# Altium schematic sheet AUX_SteeringWheel_v5.SchDoc
size Letter
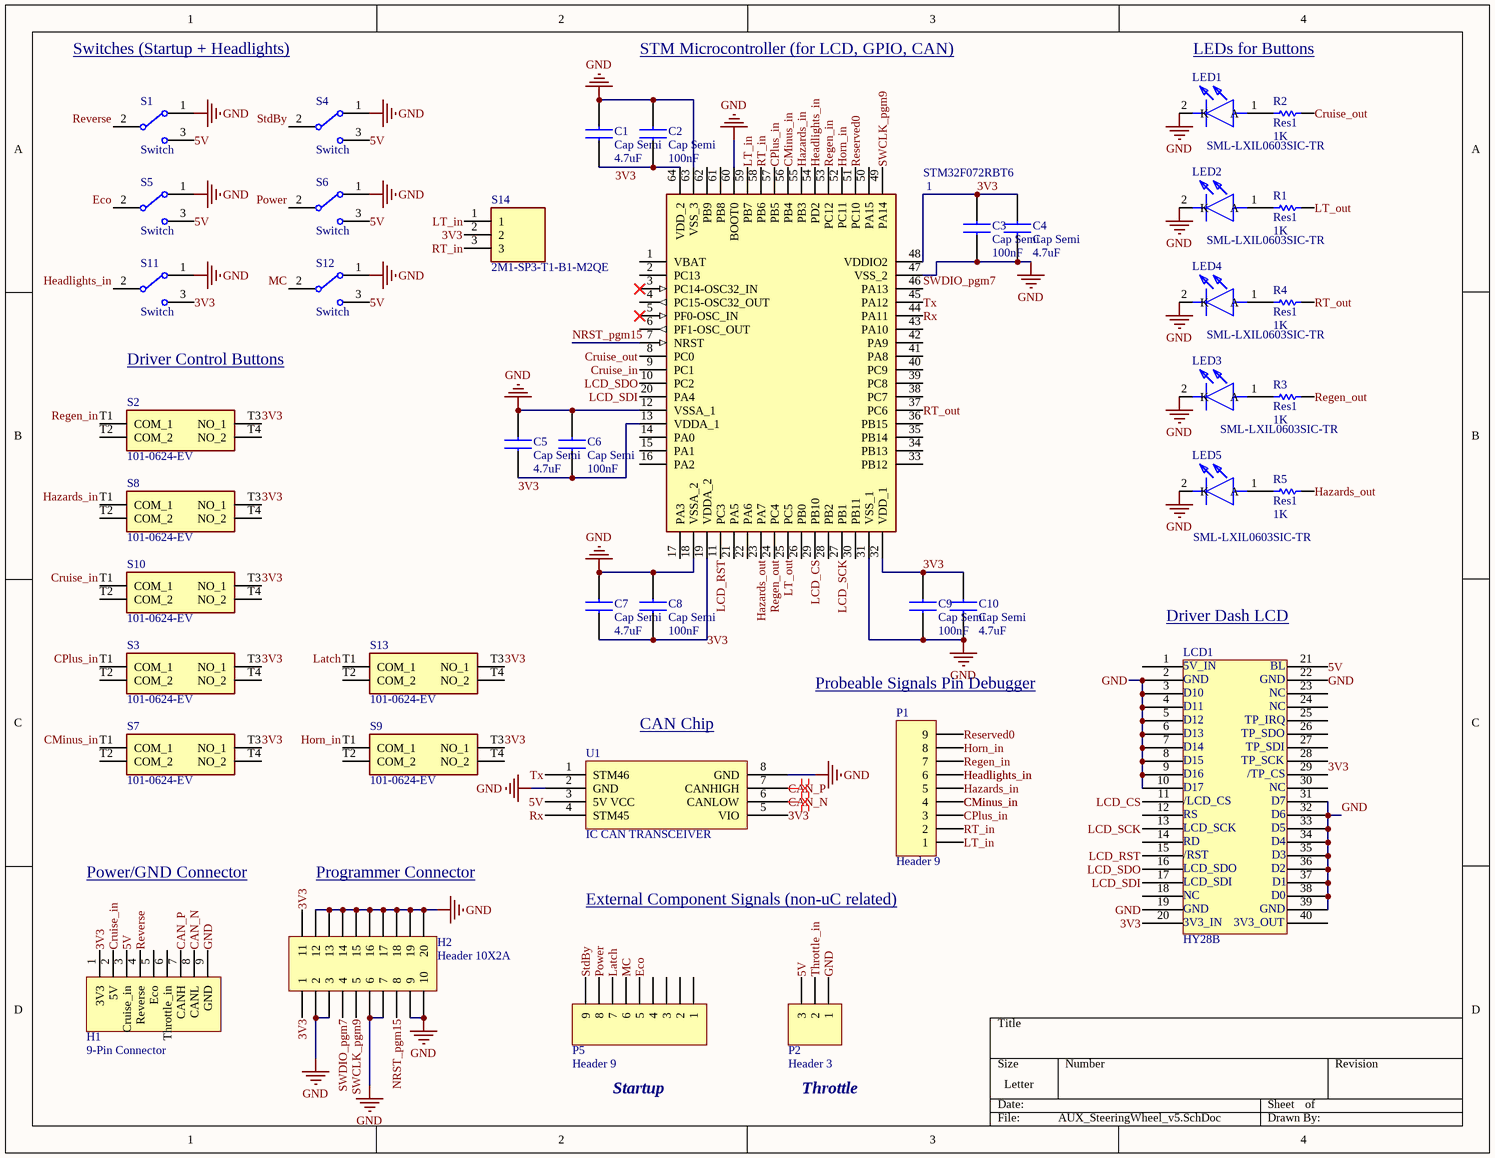
[diagram p0: AUX_SteeringWheel_v5.SchDoc]

## Parts
1  STM32F072RBT6  [QFP50P1200X1200X160-64N]
C1  Cap Semi  value 4.7uF  [CAPC3216X90N]
C2  Cap Semi  value 100nF  [CAPC3216X88N]
C3  Cap Semi  value 100nF  [CAPC3216X88N]
C4  Cap Semi  value 4.7uF  [CAPC3216X90N]
C5  Cap Semi  value 4.7uF  [CAPC3216X90N]
C6  Cap Semi  value 100nF  [CAPC3216X88N]
C7  Cap Semi  value 4.7uF  [CAPC3216X90N]
C8  Cap Semi  value 100nF  [CAPC3216X88N]
C9  Cap Semi  value 100nF  [CAPC3216X88N]
C10  Cap Semi  value 4.7uF  [CAPC3216X90N]
H1  9-Pin Connector  [Rt_Angle_9-Pin]
H2  Header 10X2A  [HDR2X10_CEN]
LCD1  HY28B
LED1  SML-LXIL0603SIC-TR  [LED thru hole]
LED2  SML-LXIL0603SIC-TR  [LED thru hole]
LED3  SML-LXIL0603SIC-TR  [LED thru hole]
LED4  SML-LXIL0603SIC-TR  [LED thru hole]
LED5  SML-LXIL0603SIC-TR  [LED thru hole]
P1  Header 9  [HDR1X9]
P2  Header 3  [HDR1X3]
P5  Header 9  [Rt_Angle_9-Pin]
R1  Res1  value 1K  [AXIAL-0.3]
R2  Res1  value 1K  [AXIAL-0.3]
R3  Res1  value 1K  [AXIAL-0.3]
R4  Res1  value 1K  [AXIAL-0.3]
R5  Res1  value 1K  [AXIAL-0.3]
S1  Switch  [100SP1T1B4M2QE]
S2  101-0624-EV  [1010624EV]
S3  101-0624-EV  [1010624EV]
S4  Switch  [100SP1T1B4M2QE]
S5  Switch  [100SP1T1B4M2QE]
S6  Switch  [100SP1T1B4M2QE]
S7  101-0624-EV  [1010624EV]
S8  101-0624-EV  [1010624EV]
S9  101-0624-EV  [1010624EV]
S10  101-0624-EV  [1010624EV]
S11  Switch  [100SP1T1B4M2QE]
S12  Switch  [100SP1T1B4M2QE]
S13  101-0624-EV  [1010624EV]
S14  2M1-SP3-T1-B1-M2QE  [2M1SP3T1B1M2QE]
U1  IC CAN TRANSCEIVER  [CAN TRANSCEIVER]

## Nets
GND: 1.12(VSSA_1) 1.18(VSSA_2) 1.31(VSS_1) 1.47(VSS_2) 1.60(BOOT0) 1.63(VSS_3) C1.2 C2.2 C3.1 C4.1 C5.2 C6.2 C7.2 C8.2 C9.1 C10.1 H1.9(GND) H2.2 H2.3 H2.6 H2.7 H2.9 H2.10 H2.12 H2.13 H2.14 H2.15 H2.16 H2.17 H2.18 H2.19 H2.20 LCD1.2 LCD1.3 LCD1.4 LCD1.5 LCD1.6 LCD1.7 LCD1.8 LCD1.9 LCD1.10 LCD1.19 LCD1.22 LCD1.31 LCD1.32 LCD1.33 LCD1.34 LCD1.35 LCD1.36 LCD1.37 LCD1.38 LCD1.39 LED1.2(K) LED2.2(K) LED3.2(K) LED4.2(K) LED5.2(K) P2.1 S1.1(NC) S4.1(NC) S5.1(NC) S6.1(NC) S11.1(NC) S12.1(NC) U1.2(GND) U1.8(GND)
3V3: 1.13(VDDA_1) 1.19(VDDA_2) 1.32(VDD_1) 1.48(VDDIO2) 1.64(VDD_2) C1.1 C2.1 C3.2 C4.2 C5.1 C6.1 C7.1 C8.1 C9.2 C10.2 H1.1(3V3) H2.1 H2.11 LCD1.20 LCD1.29 S2.T3(NO_1) S3.T3(NO_1) S7.T3(NO_1) S8.T3(NO_1) S9.T3(NO_1) S10.T3(NO_1) S11.3(NO) S13.T3(NO_1) S14.2 U1.5(VIO)
5V: H1.3(Cruise_in) LCD1.21 P2.3 S1.3(NO) S4.3(NO) S5.3(NO) S6.3(NO) S12.3(NO) U1.3(5V_VCC)
CAN_N: H1.8(CANL) U1.6(CANLOW)
CAN_P: H1.7(CANH) U1.7(CANHIGH)
CMinus_in: 1.56(PB4) P1.4 S7.T1(COM_1)
CPlus_in: 1.57(PB5) P1.3 S3.T1(COM_1)
Cruise_in: 1.9(PC1) H1.2(5V) S10.T1(COM_1)
Cruise_out: 1.8(PC0) R2.1
Eco: P5.5 S5.2(COM)
Hazards_in: 1.55(PB3) P1.5 S8.T1(COM_1)
Hazards_out: 1.23(PA7) R5.1
Headlights_in: 1.54(PD2) P1.6 S11.2(COM)
Horn_in: 1.52(PC11) P1.8 S9.T1(COM_1)
Latch: P5.7 S13.T1(COM_1)
LCD_CS: 1.29(PB10) LCD1.11
LCD_RST: 1.11(PC3) LCD1.15
LCD_SCK: 1.27(PB1) LCD1.13
LCD_SDI: 1.20(PA4) LCD1.17
LCD_SDO: 1.10(PC2) LCD1.16
LT_in: 1.59(PB7) P1.1 S14.1
LT_out: 1.25(PC5) R1.1
MC: P5.6 S12.2(COM)
NRST_pgm15: 1.7(NRST) H2.8
Power: P5.8 S6.2(COM)
Regen_in: 1.53(PC12) P1.7 S2.T1(COM_1)
Regen_out: 1.24(PC4) R3.1
Reserved0: 1.51(PC10) P1.9
Reverse: H1.4(Reverse) S1.2(COM)
RT_in: 1.58(PB6) P1.2 S14.3
RT_out: 1.37(PC6) R4.1
Rx: 1.44(PA11) U1.4(STM45)
StdBy: P5.9 S4.2(COM)
SWCLK_pgm9: 1.49(PA14) H2.5
SWDIO_pgm7: 1.46(PA13) H2.4
Throttle_in: P2.2
Tx: 1.45(PA12) U1.1(STM46)
NetLED1_1: LED1.1(A) R2.2
NetLED2_1: LED2.1(A) R1.2
NetLED3_1: LED3.1(A) R3.2
NetLED4_1: LED4.1(A) R4.2
NetLED5_1: LED5.1(A) R5.2

Not connected (* = marked no-connect by the designer): 1 1(VBAT) 2(PC13) 3(PC14-OSC32_IN)* 4(PC15-OSC32_OUT) 5(PF0-OSC_IN)* 6(PF1-OSC_OUT) 14(PA0) 15(PA1) 16(PA2) 17(PA3) 21(PA5) 22(PA6) 26(PB0) 28(PB2) 30(PB11) 33(PB12) 34(PB13) 35(PB14) 36(PB15) 38(PC7) 39(PC8) 40(PC9) 41(PA8) 42(PA9) 43(PA10) 50(PA15) 61(PB8) 62(PB9); H1 5(Eco) 6(Throttle_in); LCD1 1 12 14 18 23 24 25 26 27 28 30 40; P5 1 2 3 4; S2 T2(COM_2) T4(NO_2); S3 T2(COM_2) T4(NO_2); S7 T2(COM_2) T4(NO_2); S8 T2(COM_2) T4(NO_2); S9 T2(COM_2) T4(NO_2); S10 T2(COM_2) T4(NO_2); S13 T2(COM_2) T4(NO_2)

## Layout directives
differential pair: CAN_N, CAN_P

## Notes on the sheet
- Switches (Startup + Headlights)
- STM Microcontroller (for LCD, GPIO, CAN)
- LEDs for Buttons
- Driver Control Buttons
- (near LCD1) Driver Dash LCD
- Probeable Signals Pin Debugger
- (near U1) CAN Chip
- Power/GND Connector
- Programmer Connector
- External Component Signals (non-uC related)
- Startup
- Throttle
- (in symbol HY28B) 5V_IN; BL; GND; D10; NC; D11; D12; TP_IRQ; D13; TP_SDO; D14; TP_SDI; D15; TP_SCK; D16; /TP_CS; D17; /LCD_CS; D7; RS; D6; LCD_SCK; D5; RD; D4; /RST; D3; LCD_SDO; D2; LCD_SDI; D1; D0; 3V3_IN; 3V3_OUT

## Library data of the parts
1 = STM32F072RBT6: Integrated Circuit; Manufacturer_Name: STMicroelectronics; Datasheet Link: https://componentsearchengine.com/Datasheets/1/STM32F072RBT6.pdf; Height: 1.6mm; Mouser Part Number: 511-STM32F072RBT6; Mouser Price/Stock: https://www.mouser.com/Search/Refine.aspx?Keyword=511-STM32F072RBT6; Manufacturer_Part_Number: STM32F072RBT6
C1 C4 C5 C7 C10 = 1206X475K250CT: Manufacturer_Name: Walsin Technology Corporation; Datasheet Link: https://ms.componentsearchengine.com/Datasheets/2/1206X475K250CT.pdf; Height: 0.9mm; Manufacturer_Part_Number: 1206X475K250CT
C2 C3 C6 C8 C9 = C1206C104K5RAC7411: Manufacturer_Name: Kemet; Datasheet Link: https://ms.componentsearchengine.com/Datasheets/1/C1206C104K5RAC7411.pdf; Height: 0.88mm; Manufacturer_Part_Number: C1206C104K5RAC7411
H2 = Header 10X2A: Header, 10-Pin, Dual row; LatestRevisionDate: 17-Jul-2002; LatestRevisionNote: Re-released for DXP Platform.; Publisher: Altium Limited
LCD1 = HY28B: 2.8" LCD
LED1 LED2 LED4 = SML-LXIL0603SIC-TR: Cruise; Manufacturer_Name: Lumex; Datasheet Link: https://componentsearchengine.com/Datasheets/1/SML-LXIL0603SIC-TR.pdf; Height: 1.15mm; Mouser2 Part Number: 696-SMLLXIL0603SICTR; Mouser2 Price/Stock: https://www.mouser.com/Search/Refine.aspx?Keyword=696-SMLLXIL0603SICTR; Manufacturer_Part_Number: SML-LXIL0603SIC-TR; ComponentLink1Description: Red; ComponentLink1URL: https://www.mouser.com/ProductDetail/Lumex/SML-LXIL0603SIC-TR?qs=sGAEpiMZZMseGfSY3csMkdgyOOAg6kv2wBhnt1KKZ0Ir1Jo46E1V3Q%3D%3D; ComponentLink2Description: Green; ComponentLink2URL: https://www.mouser.com/ProductDetail/Lumex/SML-LXIL0603UPGCTR?qs=sGAEpiMZZMseGfSY3csMkdgyOOAg6kv2sRjHcnaWQfp%2F9Np9qK5zmw%3D%3D; ComponentLink3Description: Blue; ComponentLink3URL: https://www.mouser.com/ProductDetail/Lumex/SML-LXIL0603USBCTR?qs=sGAEpiMZZMseGfSY3csMkdgyOOAg6kv2YTCj%2FpdrnHQXx1e9lymIRQ%3D%3D
LED3 = SML-LXIL0603SIC-TR: Headlights; Manufacturer_Name: Lumex; Datasheet Link: https://componentsearchengine.com/Datasheets/1/SML-LXIL0603SIC-TR.pdf; Height: 1.15mm; Mouser2 Part Number: 696-SMLLXIL0603SICTR; Mouser2 Price/Stock: https://www.mouser.com/Search/Refine.aspx?Keyword=696-SMLLXIL0603SICTR; Manufacturer_Part_Number: SML-LXIL0603SIC-TR; ComponentLink1Description: Red; ComponentLink1URL: https://www.mouser.com/ProductDetail/Lumex/SML-LXIL0603SIC-TR?qs=sGAEpiMZZMseGfSY3csMkdgyOOAg6kv2wBhnt1KKZ0Ir1Jo46E1V3Q%3D%3D; ComponentLink2Description: Green; ComponentLink2URL: https://www.mouser.com/ProductDetail/Lumex/SML-LXIL0603UPGCTR?qs=sGAEpiMZZMseGfSY3csMkdgyOOAg6kv2sRjHcnaWQfp%2F9Np9qK5zmw%3D%3D; ComponentLink3Description: Blue; ComponentLink3URL: https://www.mouser.com/ProductDetail/Lumex/SML-LXIL0603USBCTR?qs=sGAEpiMZZMseGfSY3csMkdgyOOAg6kv2YTCj%2FpdrnHQXx1e9lymIRQ%3D%3D
LED5 = SML-LXIL0603SIC-TR: Hazards; Manufacturer_Name: Lumex; Datasheet Link: https://componentsearchengine.com/Datasheets/1/SML-LXIL0603SIC-TR.pdf; Height: 1.15mm; Mouser2 Part Number: 696-SMLLXIL0603SICTR; Mouser2 Price/Stock: https://www.mouser.com/Search/Refine.aspx?Keyword=696-SMLLXIL0603SICTR; Manufacturer_Part_Number: SML-LXIL0603SIC-TR; ComponentLink1Description: Red; ComponentLink1URL: https://www.mouser.com/ProductDetail/Lumex/SML-LXIL0603SIC-TR?qs=sGAEpiMZZMseGfSY3csMkdgyOOAg6kv2wBhnt1KKZ0Ir1Jo46E1V3Q%3D%3D; ComponentLink2Description: Green; ComponentLink2URL: https://www.mouser.com/ProductDetail/Lumex/SML-LXIL0603UPGCTR?qs=sGAEpiMZZMseGfSY3csMkdgyOOAg6kv2sRjHcnaWQfp%2F9Np9qK5zmw%3D%3D; ComponentLink3Description: Blue; ComponentLink3URL: https://www.mouser.com/ProductDetail/Lumex/SML-LXIL0603USBCTR?qs=sGAEpiMZZMseGfSY3csMkdgyOOAg6kv2YTCj%2FpdrnHQXx1e9lymIRQ%3D%3D
P1 P5 = Header 9: Header, 9-Pin; LatestRevisionDate: 17-Jul-2002; LatestRevisionNote: Re-released for DXP Platform.; Publisher: Altium Limited
P2 = Header 3: Header, 3-Pin; LatestRevisionDate: 17-Jul-2002; LatestRevisionNote: Re-released for DXP Platform.; Publisher: Altium Limited
R1-R5 = Res1: Resistor; Published: 8-Jun-2000; LatestRevisionDate: 17-Jul-2002; LatestRevisionNote: Re-released for DXP Platform.; PackageReference: AXIAL-0.3; Publisher: Altium Limited; PackageDescription: Axial Device, Thru-Hole; 2 Leads; 0.3 in Pin Spacing
S1 S4-S6 S11 S12 = 100SP1T1B1M2QEH: Manufacturer_Name: E-Switch; Datasheet Link: https://componentsearchengine.com//100SP1T1B1M2QEH.pdf; Height: 28mm; Mouser2 Part Number: 612-100-A1121; Mouser2 Price/Stock: https://www.mouser.com/Search/Refine.aspx?Keyword=612-100-A1121; Manufacturer_Part_Number: 100SP1T1B1M2QEH
S2 S3 S7-S10 S13 = 101-0624-EV: Switch; Manufacturer_Name: Mountain Switch; Datasheet Link: https://componentsearchengine.com/Datasheets/1/101-0624-EV.pdf; Height: 7.3mm; Mouser Part Number: 101-0624-EV; Mouser Price/Stock: https://www.mouser.com/Search/Refine.aspx?Keyword=101-0624-EV; Manufacturer_Part_Number: 101-0624-EV
S14 = 2M1-SP3-T1-B1-M2QE: Switch; Manufacturer_Name: Carling Technologies; Datasheet Link: https://www.carlingtech.com/sites/default/files/documents/Carling-MTS-2M-Series.pdf; Height: 28.2mm; Mouser2 Part Number: 691-2M1-SP3-T1B1M2QE; Mouser2 Price/Stock: https://www.mouser.com/Search/Refine.aspx?Keyword=691-2M1-SP3-T1B1M2QE; Manufacturer_Part_Number: 2M1-SP3-T1-B1-M2QE
U1 = CAN TRANSCEIVER